# EAGLE schematic DAq2017 (EAGLE 7.2.0)
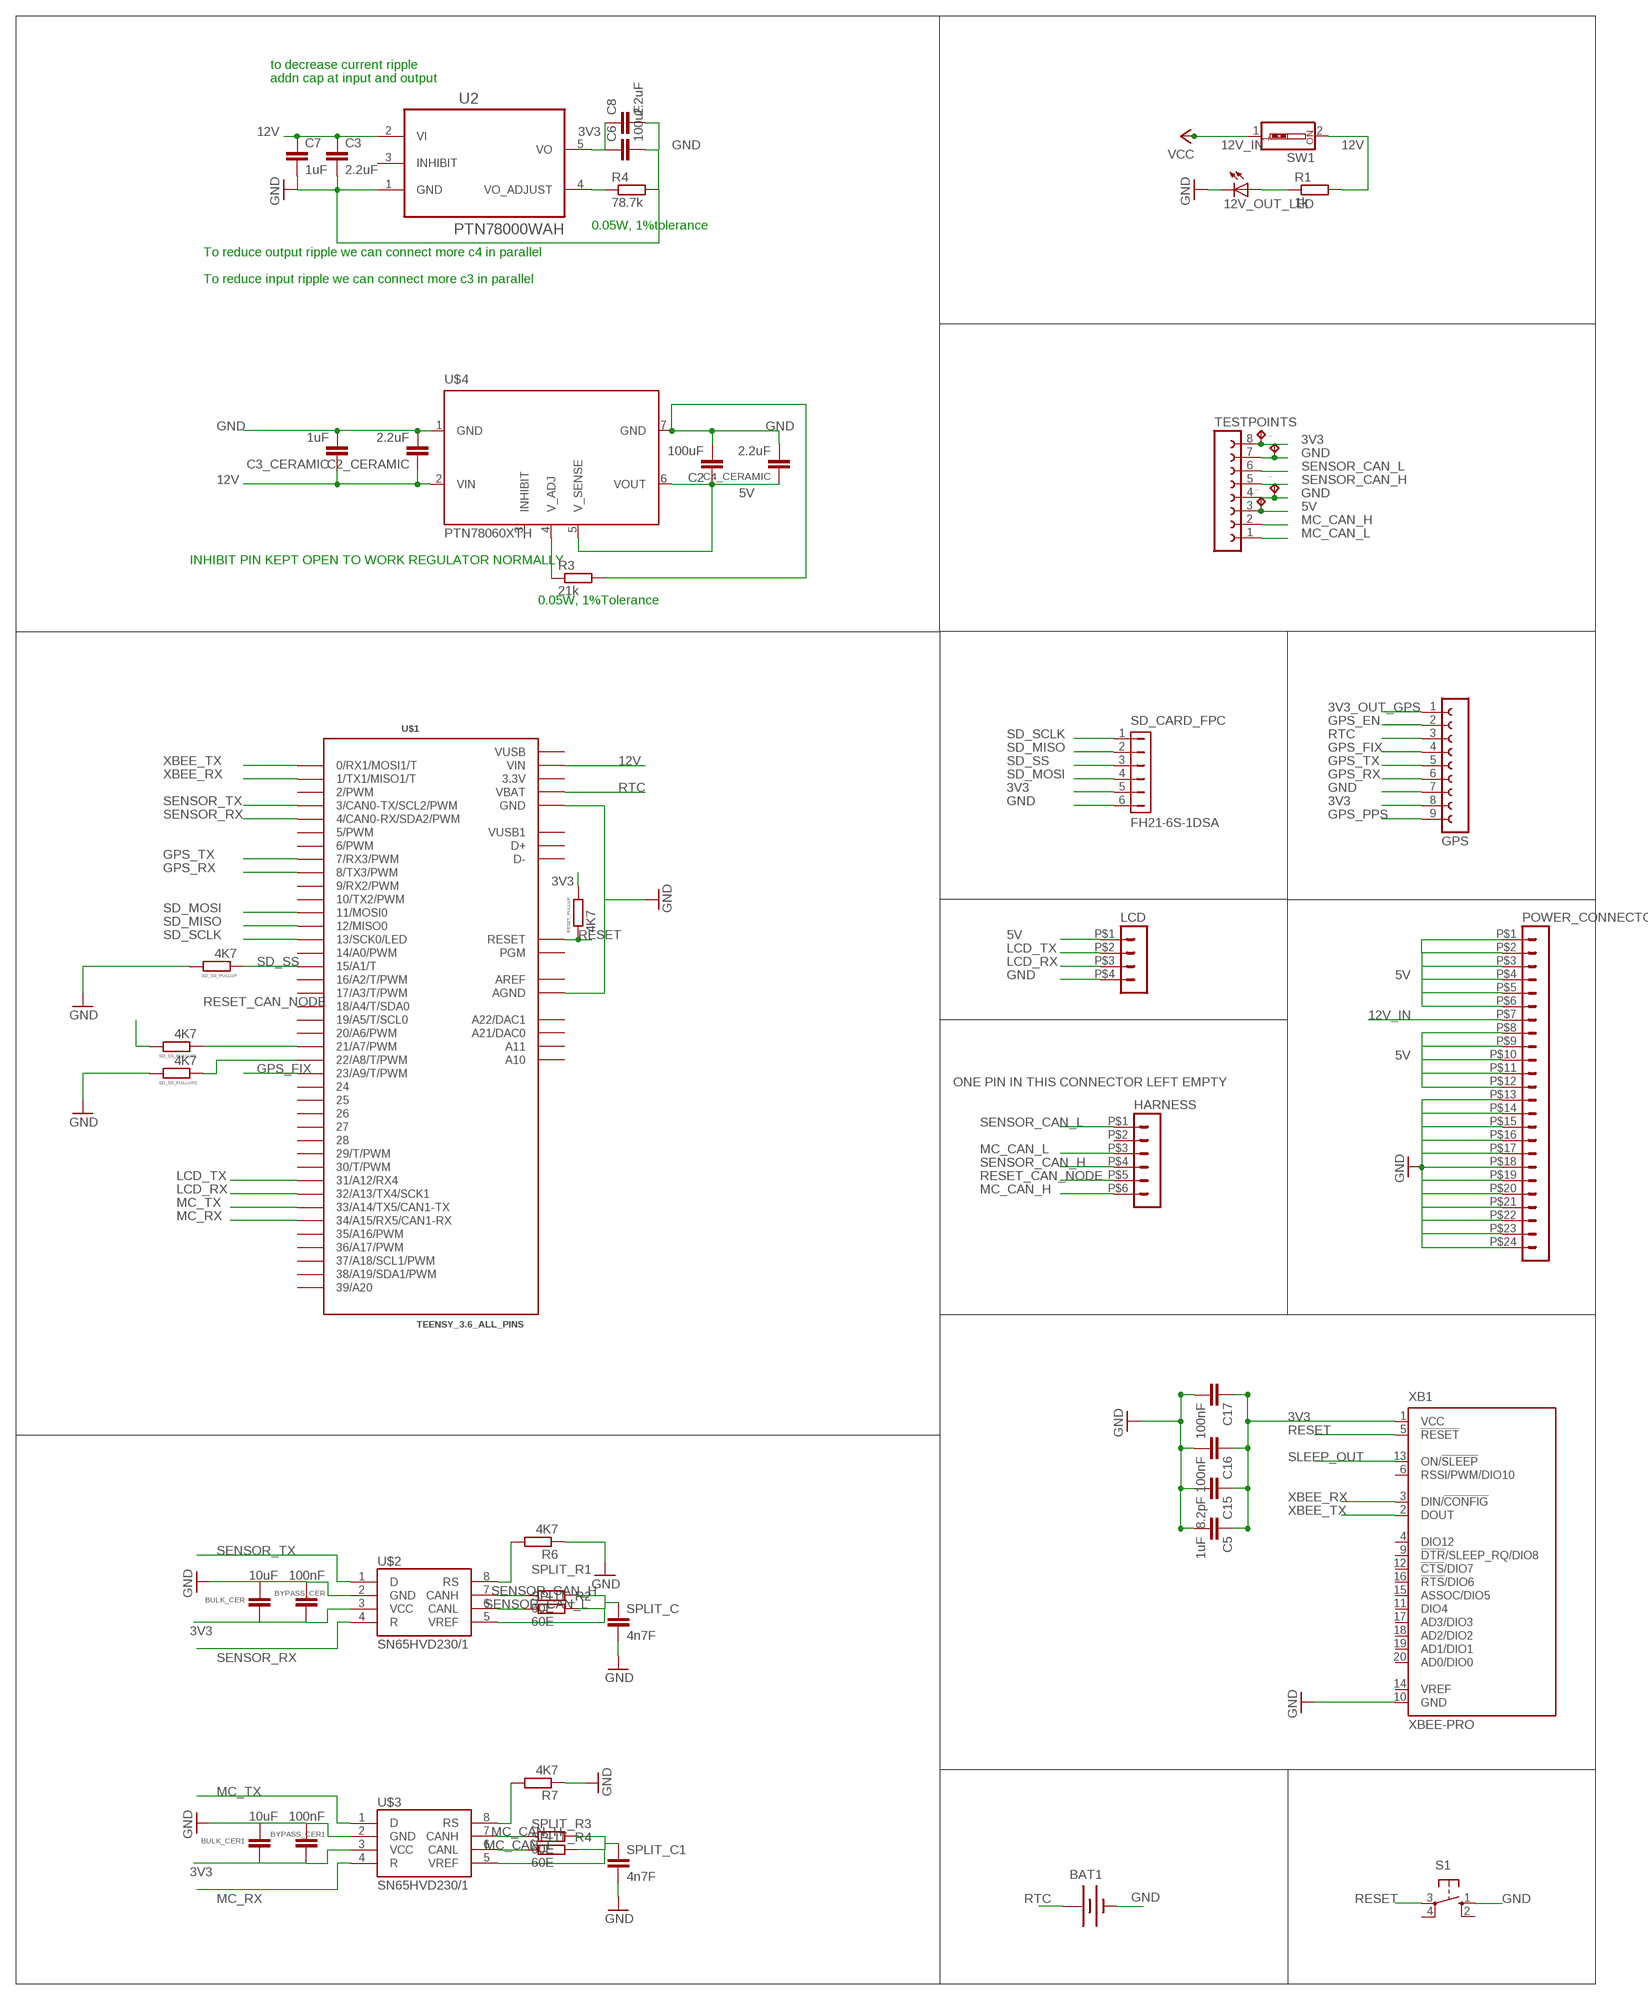
[diagram p0: schematic, sheet 1]

## Parts
12V_OUT_LED  LEDCHIPLED_1206  [CHIPLED_1206]
BAT1  BATTERY20PTH  [BATTCOM_20MM_PTH]
BULK_CER  10uF  C-EUC0805  [C0805]
BULK_CER1  10uF  C-EUC0805  [C0805]
BYPASS_CER  100nF  C-EUC0805  [C0805]
BYPASS_CER1  100nF  C-EUC0805  [C0805]
C2  100uF  C-EUC0805  [C0805]
C2_CERAMIC  2.2uF  C-EUC0805  [C0805]
C3  2.2uF  C-EUC0805  [C0805]
C3_CERAMIC  1uF  C-EUC0805  [C0805]
C4_CERAMIC  2.2uF  C-EUC0805  [C0805]
C5  1uF  C-EUC0805  [C0805]
C6  100uF  C-EUC0805  [C0805]
C7  1uF  C-EUC0805  [C0805]
C8  2.2uF  C-EUC0805  [C0805]
C15  8.2pF  C-EUC0805  [C0805]
C16  100nF  C-EUC0805  [C0805]
C17  100nF  C-EUC0805  [C0805]
GPS  FE09-1  [FE09]
HARNESS  HEADER_POS6_43045-0612  [43045-0612]
LCD  HEADER_POS4_43045-0412  [43045-0412]
POWER_CONNECTOR  HEADER_POS24_43045-2412  [43045-2412]
R1  1k  R-EU_R0805  [R0805]
R3  21k  R-EU_R0805  [R0805]
R4  78.7k  R-EU_R0805  [R0805]
R6  4K7  R-EU_R0805  [R0805]
R7  4K7  R-EU_R0805  [R0805]
RESET_PULLUP  4K7  R-EU_R0805  [R0805]
S1  10-XX  [B3F-10XX]
SD_CARD_FPC  FH21-6S-1DSA  [FH21-6S-1DSA]
SD_SS_PULLUP  4K7  R-EU_R0805  [R0805]
SD_SS_PULLUP1  4K7  R-EU_R0805  [R0805]
SD_SS_PULLUP2  4K7  R-EU_R0805  [R0805]
SPLIT_C  4n7F  C-EUC0805  [C0805]
SPLIT_C1  4n7F  C-EUC0805  [C0805]
SPLIT_R1  60E  R-EU_R0805  [R0805]
SPLIT_R2  60E  R-EU_R0805  [R0805]
SPLIT_R3  60E  R-EU_R0805  [R0805]
SPLIT_R4  60E  R-EU_R0805  [R0805]
SW1  SW_DIP-1  [EDG-01]
TESTPOINTS  FE08-1  [FE08]
TP2  TPPAD1-17Y  [P1-17Y]
TP3  TPPAD1-17Y  [P1-17Y]
TP4  TPPAD1-17Y  [P1-17Y]
TP5  TPPAD1-17Y  [P1-17Y]
U2  PTN78000WAH  [TI_PTN78000WAH]
U$1  TEENSY_3.6_ALL_PINS  [TEENSY_3.6_ALL_PINS]
U$2  SN65HVD230/1  [SO8]
U$3  SN65HVD230/1  [SO8]
U$4  PTN78060XTH  [PTN78060X_TH]
XB1  XBEE-PRO  [XBEE-PRO]

## Nets
3V3: BULK_CER1.1 BULK_CER.1 BYPASS_CER1.1 BYPASS_CER.1 C5.1 C6.1 C8.1 C15.1 C16.1 C17.1 GPS.8 RESET_PULLUP.2 SD_CARD_FPC.5 SD_SS_PULLUP1.2 TESTPOINTS.8 TP2.TP U2.5(VO) U$2.3(VCC) U$3.3(VCC) XB1.1(VCC)
3V3_OUT_GPS: GPS.1
5V: C2.1 C4_CERAMIC.1 LCD.P$1 POWER_CONNECTOR.P$1 POWER_CONNECTOR.P$2 POWER_CONNECTOR.P$3 POWER_CONNECTOR.P$4 POWER_CONNECTOR.P$5 POWER_CONNECTOR.P$6 POWER_CONNECTOR.P$8 POWER_CONNECTOR.P$9 POWER_CONNECTOR.P$10 POWER_CONNECTOR.P$11 POWER_CONNECTOR.P$12 TESTPOINTS.3 TP5.TP U$4.5(V_SENSE) U$4.6(VOUT)
12V: C2_CERAMIC.1 C3.1 C3_CERAMIC.1 C7.1 R1.2 SW1.2 U2.2(VI) U$1.VIN U$4.2(VIN)
12V_IN: POWER_CONNECTOR.P$7 SW1.1 ; supply symbol labelled VCC
GND: 12V_OUT_LED.C BAT1.2(-) BULK_CER1.2 BULK_CER.2 BYPASS_CER1.2 BYPASS_CER.2 C2.2 C2_CERAMIC.2 C3.2 C3_CERAMIC.2 C4_CERAMIC.2 C5.2 C6.2 C7.2 C8.2 C15.2 C16.2 C17.2 GPS.7 LCD.P$4 POWER_CONNECTOR.P$13 POWER_CONNECTOR.P$14 POWER_CONNECTOR.P$15 POWER_CONNECTOR.P$16 POWER_CONNECTOR.P$17 POWER_CONNECTOR.P$18 POWER_CONNECTOR.P$19 POWER_CONNECTOR.P$20 POWER_CONNECTOR.P$21 POWER_CONNECTOR.P$22 POWER_CONNECTOR.P$23 POWER_CONNECTOR.P$24 R3.2 R4.2 R6.1 R7.1 S1.1(S) SD_CARD_FPC.6 SD_SS_PULLUP2.2 SD_SS_PULLUP.2 SPLIT_C1.2 SPLIT_C.2 TESTPOINTS.4 TESTPOINTS.7 TP3.TP TP4.TP U2.1(GND) U$1.AGND U$1.GND U$1.GND1(GND) U$1.GND3(GND) U$1.GND4(GND) U$1.GND6(GND) U$2.2(GND) U$3.2(GND) U$4.1(GND) U$4.7(GND) XB1.10(GND)
GPS_EN: GPS.2
GPS_FIX: GPS.4 U$1.23/A9(23/A9/T/PWM)
GPS_PPS: GPS.9
GPS_RX: GPS.6 U$1.8(8/TX3/PWM)
GPS_TX: GPS.5 U$1.7(7/RX3/PWM)
LCD_RX: LCD.P$3 U$1.32/A13(32/A13/TX4/SCK1)
LCD_TX: LCD.P$2 U$1.31/A12(31/A12/RX4)
LULZ: R6.2 U$2.8(RS)
MC_CAN_H: HARNESS.P$6 SPLIT_R3.1 TESTPOINTS.2 U$3.7(CANH)
MC_CAN_L: HARNESS.P$3 SPLIT_R4.1 TESTPOINTS.1 U$3.6(CANL)
MC_RX: U$1.34/A15(34/A15/RX5/CAN1-RX) U$3.4(R)
MC_TX: U$1.33/A14(33/A14/TX5/CAN1-TX) U$3.1(D)
N$1: SD_SS_PULLUP2.1 U$1.22/A8(22/A8/T/PWM)
N$2: R3.1 U$4.4(V_ADJ)
N$3: R4.1 U2.4(VO_ADJUST)
N$5: 12V_OUT_LED.A R1.1
N$6: R7.2 U$3.8(RS)
N$7: SPLIT_C1.1 SPLIT_R3.2 SPLIT_R4.2 U$3.5(VREF)
N$9: SPLIT_C.1 SPLIT_R1.2 SPLIT_R2.2 U$2.5(VREF)
RESET: RESET_PULLUP.1 S1.3(P) U$1.RESET XB1.5(!RESET)
RESET_CAN_NODE: HARNESS.P$5 SD_SS_PULLUP1.1 U$1.21/A7(21/A7/PWM)
RTC: BAT1.1(+) GPS.3 U$1.VBAT
SD_MISO: SD_CARD_FPC.2 U$1.12(12/MISO0)
SD_MOSI: SD_CARD_FPC.4 U$1.11(11/MOSI0)
SD_SCLK: SD_CARD_FPC.1 U$1.13(13/SCK0/LED)
SD_SS: SD_CARD_FPC.3 SD_SS_PULLUP.1 U$1.15/A1(15/A1/T)
SENSOR_CAN_H: HARNESS.P$4 SPLIT_R1.1 TESTPOINTS.5 U$2.7(CANH)
SENSOR_CAN_L: HARNESS.P$1 SPLIT_R2.1 TESTPOINTS.6 U$2.6(CANL)
SENSOR_RX: U$1.4(4/CAN0-RX/SDA2/PWM) U$2.4(R)
SENSOR_TX: U$1.3(3/CAN0-TX/SCL2/PWM) U$2.1(D)
SLEEP_OUT: XB1.13(ON/!SLEEP)
XBEE_RX: U$1.1(1/TX1/MISO1/T) XB1.3(DIN/!CONFIG)
XBEE_TX: U$1.0(0/RX1/MOSI1/T) XB1.2(DOUT)
Unconnected: HARNESS.P$2 S1.2(S1) S1.4(P1) U2.3(INHIBIT) U$1.2(2/PWM) U$1.5(5/PWM) U$1.6(6/PWM) U$1.9(9/RX2/PWM) U$1.10(10/TX2/PWM) U$1.14/A0(14/A0/PWM) U$1.16/A2(16/A2/T/PWM) U$1.17/A3(17/A3/T/PWM) U$1.18/A4(18/A4/T/SDA0) U$1.19/A5(19/A5/T/SCL0) U$1.20/A6(20/A6/PWM) U$1.24 U$1.25 U$1.26 U$1.27 U$1.28 U$1.29(29/T/PWM) U$1.30(30/T/PWM) U$1.35/A16(35/A16/PWM) U$1.36/A17(36/A17/PWM) U$1.37/A18(37/A18/SCL1/PWM) U$1.38/A19(38/A19/SDA1/PWM) U$1.39/A20 U$1.A10 U$1.A11 U$1.A21(A21/DAC0) U$1.A22(A22/DAC1) U$1.D+ U$1.D- U$1.PGM U$4.3(INHIBIT) XB1.4(DIO12) XB1.6(RSSI/PWM/DIO10) XB1.9(!DTR!/SLEEP_RQ/DIO8) XB1.11(DIO4) XB1.12(!CTS!/DIO7) XB1.14(VREF) XB1.15(ASSOC/DIO5) XB1.16(!RTS!/DIO6) XB1.17(AD3/DIO3) XB1.18(AD2/DIO2) XB1.19(AD1/DIO1) XB1.20(AD0/DIO0)

## Notes on the sheet
- to decrease current ripple
- addn cap at input and output
- 0.05W, 1%tolerance
- To reduce output ripple we can connect more c4 in parallel
- To reduce input ripple we can connect more c3 in parallel
- INHIBIT PIN KEPT OPEN TO WORK REGULATOR NORMALLY
- 0.05W, 1%Tolerance
- ONE PIN IN THIS CONNECTOR LEFT EMPTY

## Power pins joined to a net without a drawn wire
3.3V: U$1.3.3V U$1.3.3V3(3.3V) U$1.3.3V4(3.3V)
AREF: U$1.AREF
VUSB: U$1.VUSB
VUSB1: U$1.VUSB1

## Library data of the parts
12V_OUT_LED = led:LED: LED OSRAM: - CHIPLED LG R971, LG N971, LY N971, LG Q971, LY Q971, LO R971, LY R971 LH N974, LH R974 LS Q976, LO Q976, LY Q976 LO Q996 - Hyper CHIPLED LW Q18S LB Q993, LB Q99A, LB R99A - SideLED LS A670, LO A670, LY A670, LG A670, LP A670 LB A673, LV A673, LT A673, LW A673 LH A674 LY A675 LS A676, LA A676, LO A676, LY A676, LW A676 LS A679, LY A679, LG A679 - Hyper Micro SIDELED® LS Y876, LA Y876, LO Y876, LY Y876 LT Y87S - SmartLED LW L88C, LW L88S LB L89C, LB L89S, LG L890 LS L89K, LO L89K, LY L89K LS L896, LA L896, LO L896, LY L896 - TOPLED LS T670, LO T670, LY T670, LG T670, LP T670 LSG T670, LSP T670, LSY T670, LOP T670, LYG T670 LG T671, LOG T671, LSG T671 LB T673, LV T673, LT T673, LW T673 LH T674 LS T676, LA T676, LO T676, LY T676, LB T676, LH T676, LSB T676, LW T676 LB T67C, LV T67C, LT T67C, LS T67K, LO T67K, LY T67K, LW E67C LS E67B, LA E67B, LO E67B, LY E67B, LB E67C, LV E67C, LT E67C LW T67C LS T679, LY T679, LG T679 LS T770, LO T770, LY T770, LG T770, LP T770 LB T773, LV T773, LT T773, LW T773 LH T774 LS E675, LA E675, LY E675, LS T675 LS T776, LA T776, LO T776, LY T776, LB T776 LHGB T686 LT T68C, LB T68C - Hyper Mini TOPLED® LB M676 - Mini TOPLED Santana® LG M470 LS M47K, LO M47K, LY M47K Source: http://www.osram.convergy.de LUXEON: - LUMILED® LXK2-PW12-R00, LXK2-PW12-S00, LXK2-PW14-U00, LXK2-PW14-V00 LXK2-PM12-R00, LXK2-PM12-S00, LXK2-PM14-U00 LXK2-PE12-Q00, LXK2-PE12-R00, LXK2-PE12-S00, LXK2-PE14-T00, LXK2-PE14-U00 LXK2-PB12-K00, LXK2-PB12-L00, LXK2-PB12-M00, LXK2-PB14-N00, LXK2-PB14-P00, LXK2-PB14-Q00 LXK2-PR12-L00, LXK2-PR12-M00, LXK2-PR14-Q00, LXK2-PR14-R00 LXK2-PD12-Q00, LXK2-PD12-R00, LXK2-PD12-S00 LXK2-PH12-R00, LXK2-PH12-S00 LXK2-PL12-P00, LXK2-PL12-Q00, LXK2-PL12-R00 Source: www.luxeon.com KINGBRIGHT: KA-3528ASYC Source: www.kingbright.com
BAT1 = SparkFun-Electromechanical:BATTERY: Battery Holders Various common sizes : AA, AAA, 18650 (PRT-12895), 20mm coin cell and 12mm coin cell. 20MM_4LEGS, BATT-10373
BULK_CER BULK_CER1 BYPASS_CER BYPASS_CER1 SPLIT_C SPLIT_C1 = LV:C-EU: CAPACITOR, European symbol
C2 C2_CERAMIC C3_CERAMIC C4_CERAMIC = resistor:C-EU: CAPACITOR, European symbol
C3 C6-C8 = rcl:C-EU: CAPACITOR, European symbol
C5 C15-C17 = Ediff+DAQ_v2:C-EU: CAPACITOR, European symbol
GPS = con-lsta:FE09-1: FEMALE HEADER; OC_FARNELL: unknown; OC_NEWARK: unknown
HARNESS = con-molex-micro-fit-3_0:HEADER_POS6_?: Molex - Micro-Fit 3.0 Series connector, 3.00mm (0.118") pitch header, 6 positions.
LCD = con-molex-micro-fit-3_0:HEADER_POS4_?: Molex - Micro-Fit 3.0 Series connector, 3.00mm (0.118") pitch header, 4 positions.
POWER_CONNECTOR = con-molex-micro-fit-3_0:HEADER_POS24_?: Molex - Micro-Fit 3.0 Series connector, 3.00mm (0.118") pitch header, 24 positions.
R1 R3 RESET_PULLUP SD_SS_PULLUP SD_SS_PULLUP1 SD_SS_PULLUP2 = resistor:R-EU_: RESISTOR, European symbol
R4 = rcl:R-EU_: RESISTOR, European symbol
R6 R7 SPLIT_R1-SPLIT_R4 = LV:R-EU_: RESISTOR, European symbol
S1 = switch-omron:10-XX: OMRON SWITCH; MPN: B3F-1000; OC_FARNELL: 176432; OC_NEWARK: 36M3542
SD_CARD_FPC = con-hirose:FH21-6S-1DSA: FPC CONNECTOR Source: con-hirose.lbr from Bob Starr <rtzaudio@mindspring.com>; OC_FARNELL: unknown; OC_NEWARK: unknown
SW1 = special:SW_DIP-1: DIP SWITCH
TESTPOINTS = con-lsta:FE08-1: FEMALE HEADER; OC_FARNELL: unknown; OC_NEWARK: unknown
TP2-TP5 = testpad:TP: Test pad
U2 = PTN78000WAH:PTN78000WAH: SWITCHING REG, 2.5 TO 12.6V 1.5A,Through-Hole Module; MPN: PTN78000WAH; OC_FARNELL: 1564908; OC_NEWARK: 65J6317; PACKAGE: Through-Hole Module; SUPPLIER: TEXAS INSTRUMENTS
U$1 = Teensy_3_and_LC_Series_Boards_v1.4:TEENSY_3.6_ALL_PINS: All PIN version of the Teensy 3.6.
U$2 U$3 = texas_1:SN65HVD230/1
U$4 = PTN780XX:PTN78060X: 3 A Wide-input Adjustable Switching Regulator
XB1 = Ediff+DAQ_v2:XBEE: XBee (TM) /XBee-PRO(TM) OEM RF Modules Source: MaxStream, Inc. xbee_productmanual.pdf; MPN: XBP24-AWI-001; OC_FARNELL: 1337916; OC_NEWARK: 42M2667